# Altium schematic sheet ADC_Unity_Gain.SchDoc: ADC Utility Gain
size Tabloid; Date: 06/01/2023; Engineer: Terry D. Schevker; Revision: 1.0; SheetNumber: 5; SheetTotal: 7
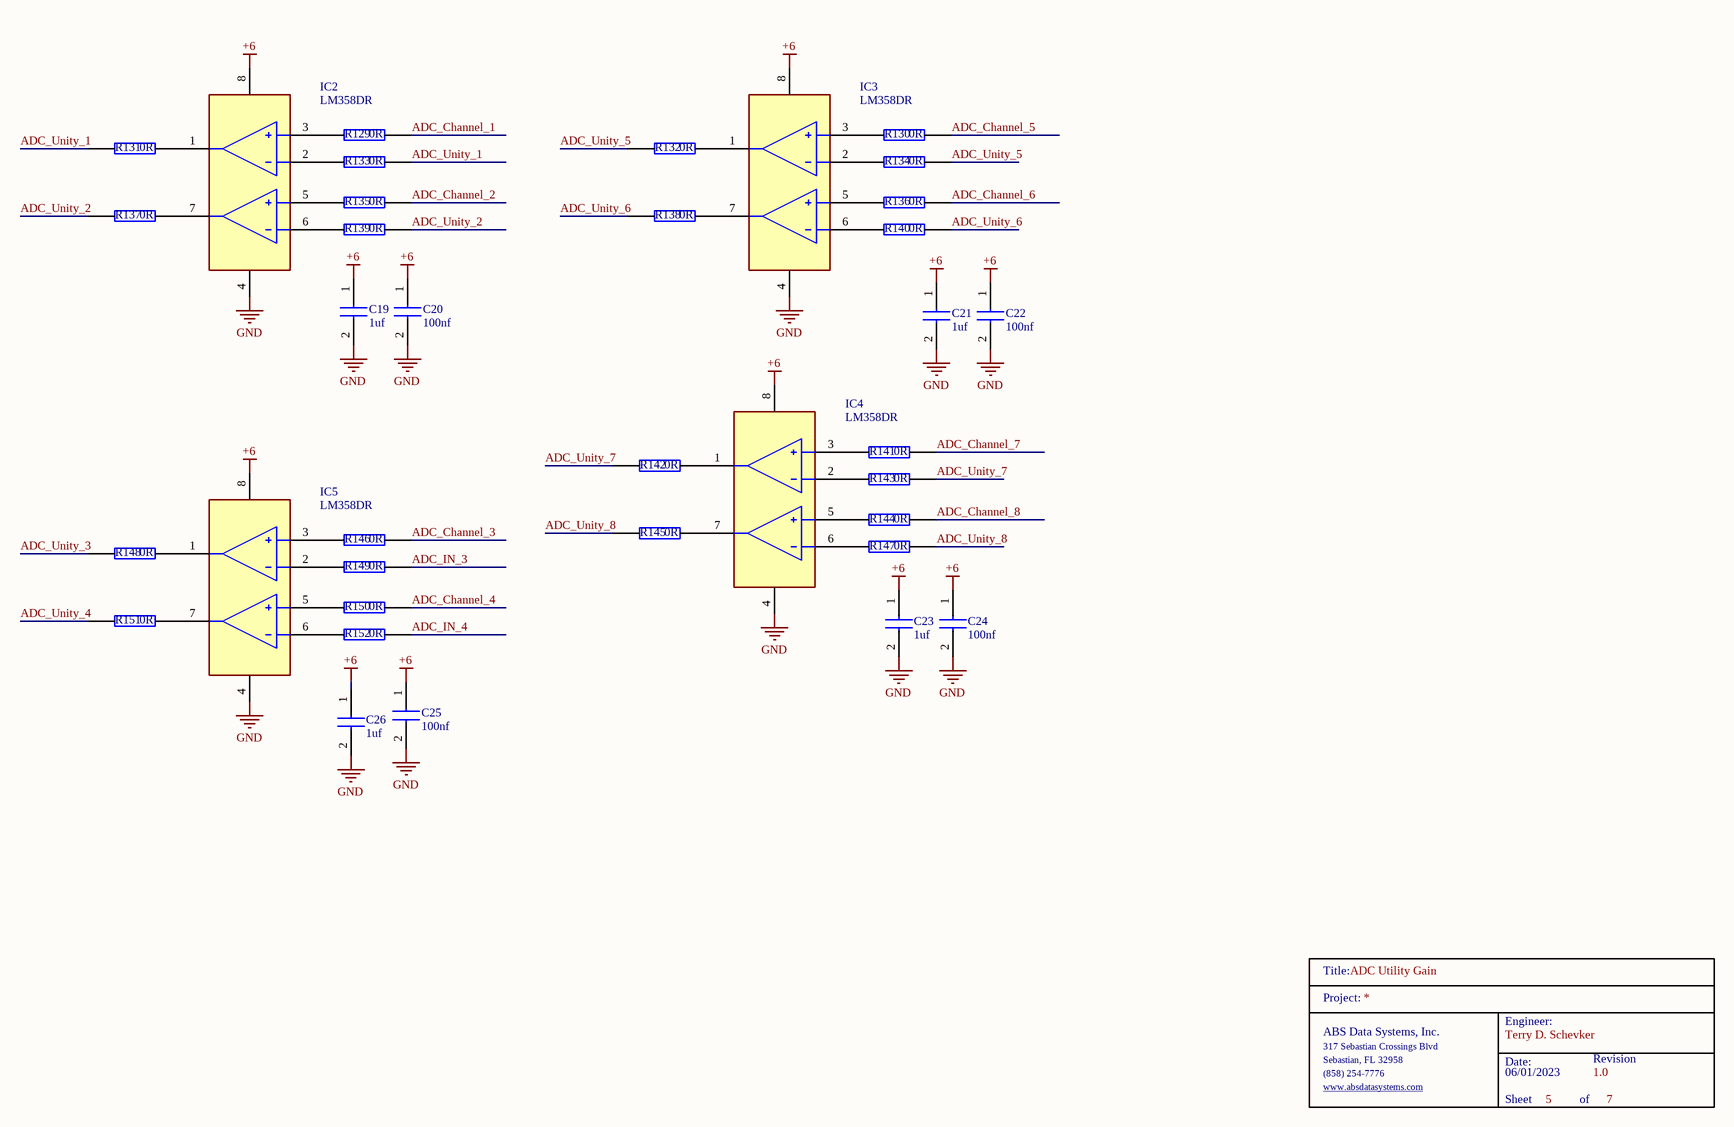
[diagram p0: ADC_Unity_Gain.SchDoc]

## Parts
C19  1uf  [0603]
C20  100nf  [0603]
C21  1uf  [0603]
C22  100nf  [0603]
C23  1uf  [0603]
C24  100nf  [0603]
C25  100nf  [0603]
C26  1uf  [0603]
IC2  LM358DR  [SOIC127P600X175-8N]
IC3  LM358DR  [SOIC127P600X175-8N]
IC4  LM358DR  [SOIC127P600X175-8N]
IC5  LM358DR  [SOIC127P600X175-8N]
R129  0R  [0603]
R130  0R  [0603]
R131  0R  [0603]
R132  0R  [0603]
R133  0R  [0603]
R134  0R  [0603]
R135  0R  [0603]
R136  0R  [0603]
R137  0R  [0603]
R138  0R  [0603]
R139  0R  [0603]
R140  0R  [0603]
R141  0R  [0603]
R142  0R  [0603]
R143  0R  [0603]
R144  0R  [0603]
R145  0R  [0603]
R146  0R  [0603]
R147  0R  [0603]
R148  0R  [0603]
R149  0R  [0603]
R150  0R  [0603]
R151  0R  [0603]
R152  0R  [0603]
TitleBlock_5  TitleBlock  (value not drawn)  (graphical)

## Nets
+6: C19.1 C20.1 C21.1 C22.1 C23.1 C24.1 C25.1 C26.1 IC2.8(V+) IC3.8(V+) IC4.8(V+) IC5.8(V+)
GND: C19.2 C20.2 C21.2 C22.2 C23.2 C24.2 C25.2 C26.2 IC2.4(V-) IC3.4(V-) IC4.4(V-) IC5.4(V-)
ADC_Channel_1: R129.2
ADC_Channel_2: R135.2
ADC_Channel_3: R146.2
ADC_Channel_4: R150.2
ADC_Channel_5: R130.2
ADC_Channel_6: R136.2
ADC_Channel_7: R141.2
ADC_Channel_8: R144.2
ADC_IN_3: R149.2
ADC_IN_4: R152.2
ADC_Unity_1: R131.1 R133.2
ADC_Unity_2: R137.1 R139.2
ADC_Unity_3: R148.1
ADC_Unity_4: R151.1
ADC_Unity_5: R132.1 R134.2
ADC_Unity_6: R138.1 R140.2
ADC_Unity_7: R142.1 R143.2
ADC_Unity_8: R145.1 R147.2
NetIC2_1: IC2.1(OUT1) R131.2
NetIC2_2: IC2.2(IN1-) R133.1
NetIC2_3: IC2.3(IN1+) R129.1
NetIC2_5: IC2.5(IN2+) R135.1
NetIC2_6: IC2.6(IN2-) R139.1
NetIC2_7: IC2.7(OUT2) R137.2
NetIC3_1: IC3.1(OUT1) R132.2
NetIC3_2: IC3.2(IN1-) R134.1
NetIC3_3: IC3.3(IN1+) R130.1
NetIC3_5: IC3.5(IN2+) R136.1
NetIC3_6: IC3.6(IN2-) R140.1
NetIC3_7: IC3.7(OUT2) R138.2
NetIC4_1: IC4.1(OUT1) R142.2
NetIC4_2: IC4.2(IN1-) R143.1
NetIC4_3: IC4.3(IN1+) R141.1
NetIC4_5: IC4.5(IN2+) R144.1
NetIC4_6: IC4.6(IN2-) R147.1
NetIC4_7: IC4.7(OUT2) R145.2
NetIC5_1: IC5.1(OUT1) R148.2
NetIC5_2: IC5.2(IN1-) R149.1
NetIC5_3: IC5.3(IN1+) R146.1
NetIC5_5: IC5.5(IN2+) R150.1
NetIC5_6: IC5.6(IN2-) R152.1
NetIC5_7: IC5.7(OUT2) R151.2

## Notes on the sheet
- (in symbol TitleBlock) Title:; Project:; Engineer:; ABS Data Systems, Inc.; 317 Sebastian Crossings Blvd; Sebastian, FL 32958; Date:; Revision; (858) 254-7776; www.absdatasystems.com; Sheet; of

## Library data of the parts
C19 C21 C23 C26 = CL10B105KA8NNNL: Samsung Electro-Mechanics 0603 1uf
C20 C22 C24 C25 = CL10B104JB8NNNC: Samsung Electro-Mechanics 0603 100nf
IC2-IC5 = LM358DR: Integrated Circuit; Manufacturer_Name: Texas Instruments; Datasheet Link: https://www.ti.com/lit/ds/symlink/lm358.pdf?ts=1593170624750&ref_url=https%253A%252F%252Fwww.ti.com%252Fstore%252Fti%252Fen%252Fp%252Fproduct%252F%253Fp%253DLM358DR%2526keyMatch%253DLM358DR%2526tisearch%253DSearch-EN-everything%2526usecase%253DOPN; Height: 1.75mm; Manufacturer_Part_Number: LM358DR; Mouser Part Number: 595-LM358DR; Mouser Price/Stock: https://www.mouser.co.uk/ProductDetail/Texas-Instruments/LM358DR?qs=Zu35EjizYSSY6pJ37yjmHA%3D%3D; Arrow Part Number: LM358DR; Arrow Price/Stock: https://www.arrow.com/en/products/lm358dr/texas-instruments?region=nac
R129-R152 = RC0603JR-070RL: YAGEO 0603 0 ohm; Manufacturer_Name: KEMET; Geometry.Height: 0.55mm; Mouser Part Number: 603-RC0603JR-070RL; Mouser Price/Stock: https://www.mouser.co.uk/ProductDetail/YAGEO/RC0603JR-070RL?qs=2cAdsCoAWRGWyPcuXgGiXQ%3D%3D; Manufacturer_Part_Number: RC0603JR-070RL; Datasheet Link: https://datasheet.datasheetarchive.com/originals/distributors/Datasheets_SAMA/902f9e387b938f871d31120f5fc1d65e.pdf